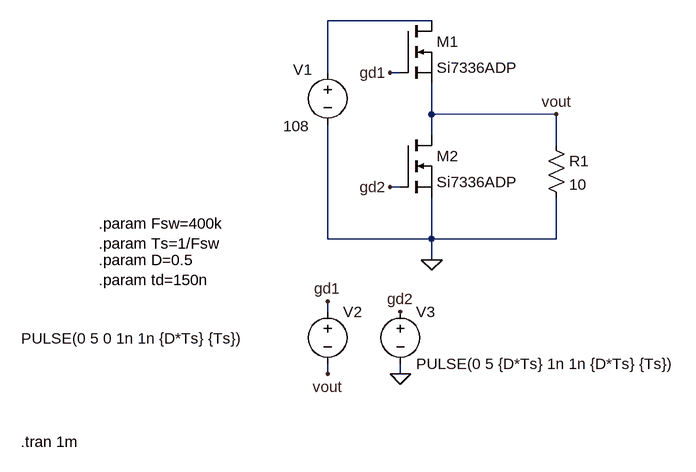
[diagram p0: schematic Half Bridge Switching.asc]
Half Bridge Switching.asc, the LTspice schematic file:
Version 4.1
SHEET 1 880 712
WIRE 272 48 112 48
WIRE 112 128 112 48
WIRE 224 128 208 128
WIRE 272 192 272 144
WIRE 464 192 272 192
WIRE 272 224 272 192
WIRE 464 240 464 192
WIRE 224 304 208 304
WIRE 112 384 112 208
WIRE 272 384 272 320
WIRE 272 384 112 384
WIRE 464 384 464 320
WIRE 464 384 272 384
WIRE 272 416 272 384
WIRE 112 496 112 480
WIRE 112 592 112 576
WIRE 224 592 224 576
FLAG 464 192 vout
FLAG 208 128 gd1
FLAG 208 304 gd2
FLAG 112 480 gd1
FLAG 112 592 vout
FLAG 224 496 gd2
FLAG 272 416 0
FLAG 224 592 0
SYMBOL voltage 112 112 R0
WINDOW 0 -53 11 Left 2
WINDOW 3 -68 98 Left 2
WINDOW 123 0 0 Left 0
WINDOW 39 0 0 Left 0
SYMATTR InstName V1
SYMATTR Value 108
SYMBOL nmos 224 48 R0
SYMATTR InstName M1
SYMATTR Value Si7336ADP
SYMBOL nmos 224 224 R0
SYMATTR InstName M2
SYMATTR Value Si7336ADP
SYMBOL voltage 112 480 R0
WINDOW 3 -471 57 Left 2
WINDOW 123 0 0 Left 0
WINDOW 39 0 0 Left 0
SYMATTR Value PULSE(0 5 0 1n 1n {D*Ts} {Ts})
SYMATTR InstName V2
SYMBOL voltage 224 480 R0
WINDOW 123 0 0 Left 0
WINDOW 39 0 0 Left 0
SYMATTR InstName V3
SYMATTR Value PULSE(0 5 {D*Ts} 1n 1n {D*Ts} {Ts})
SYMBOL res 448 224 R0
SYMATTR InstName R1
SYMATTR Value 10
TEXT -240 360 Left 2 !.param Fsw=400k\n.param Ts=1/Fsw
TEXT -240 416 Left 2 !.param D=0.5\n.param td=150n
TEXT -360 696 Left 2 !.tran 1m

The netlist it stands for:
* Half Bridge Switching.asc
V1 N001 0 108
M1 N001 gd1 vout vout Si7336ADP
M2 vout gd2 0 0 Si7336ADP
V2 gd1 vout PULSE(0 5 0 1n 1n {D*Ts} {Ts})
V3 gd2 0 PULSE(0 5 {D*Ts} 1n 1n {D*Ts} {Ts})
R1 vout 0 10
.model NMOS NMOS
.model PMOS PMOS
.lib standard.mos
.param Fsw=400k
.param Ts=1/Fsw
.param D=0.5
.param td=150n
.tran 1m
.backanno
.end